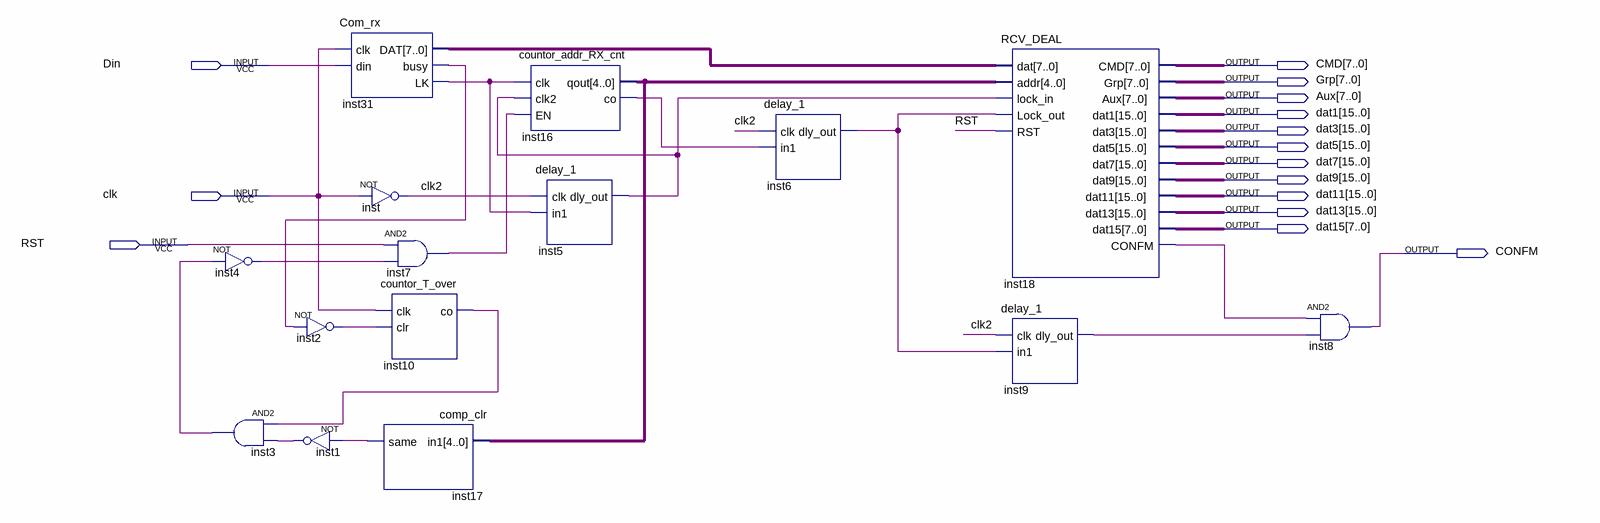
[diagram p0: schematic sheet]
// Quartus schematic Com_RXD.bdf as structural Verilog: 15 symbols, 15 pins
module Com_RXD (
  input  Din,
  input  clk,
  input  RST,
  output [7:0] CMD,
  output [7:0] Grp,
  output [7:0] Aux,
  output [15:0] dat1,
  output [15:0] dat3,
  output [15:0] dat5,
  output [15:0] dat7,
  output [15:0] dat9,
  output [15:0] dat11,
  output [15:0] dat13,
  output [7:0] dat15,
  output CONFM
);

  wire clk2, inst1_out, inst2_out, inst3_out, inst4_out, inst5_dly_out, inst6_dly_out, inst7_out,
       inst9_dly_out, inst10_co, inst16_co, inst17_same, inst18_confm, inst31_busy, inst31_lk;
  wire [4:0] inst16_qout;
  wire [7:0] inst31_dat;

  not inst4 (inst4_out, inst3_out);
  and inst3 (inst3_out, inst10_co, inst1_out);
  Com_rx inst31 (.clk(clk), .din(Din), .DAT(inst31_dat), .busy(inst31_busy), .LK(inst31_lk));
  not inst2 (inst2_out, inst31_busy);
  not inst1 (inst1_out, inst17_same);
  not inst (clk2, clk);
  and inst7 (inst7_out, RST, inst4_out);
  countor_T_over inst10 (.clk(clk), .clr(inst2_out), .co(inst10_co));
  comp_clr inst17 (.in1(inst16_qout), .same(inst17_same));
  countor_addr_RX_cnt inst16 (
    .clk(inst31_lk), .clk2(inst5_dly_out), .EN(inst7_out), .qout(inst16_qout), .co(inst16_co));
  delay_1 inst5 (.clk(clk2), .in1(inst31_lk), .dly_out(inst5_dly_out));
  delay_1 inst6 (.clk(clk2), .in1(inst16_co), .dly_out(inst6_dly_out));
  RCV_DEAL inst18 (
    .dat(inst31_dat), .addr(inst16_qout), .lock_in(inst5_dly_out), .Lock_out(inst6_dly_out), .RST(RST),
    .CMD(CMD), .Grp(Grp), .Aux(Aux), .dat1(dat1), .dat3(dat3), .dat5(dat5), .dat7(dat7), .dat9(dat9),
    .dat11(dat11), .dat13(dat13), .dat15(dat15), .CONFM(inst18_confm));
  delay_1 inst9 (.clk(clk2), .in1(inst6_dly_out), .dly_out(inst9_dly_out));
  and inst8 (CONFM, inst18_confm, inst9_dly_out);
endmodule
